# EAGLE design SpiderBackV1 (EAGLE 8.3.1)
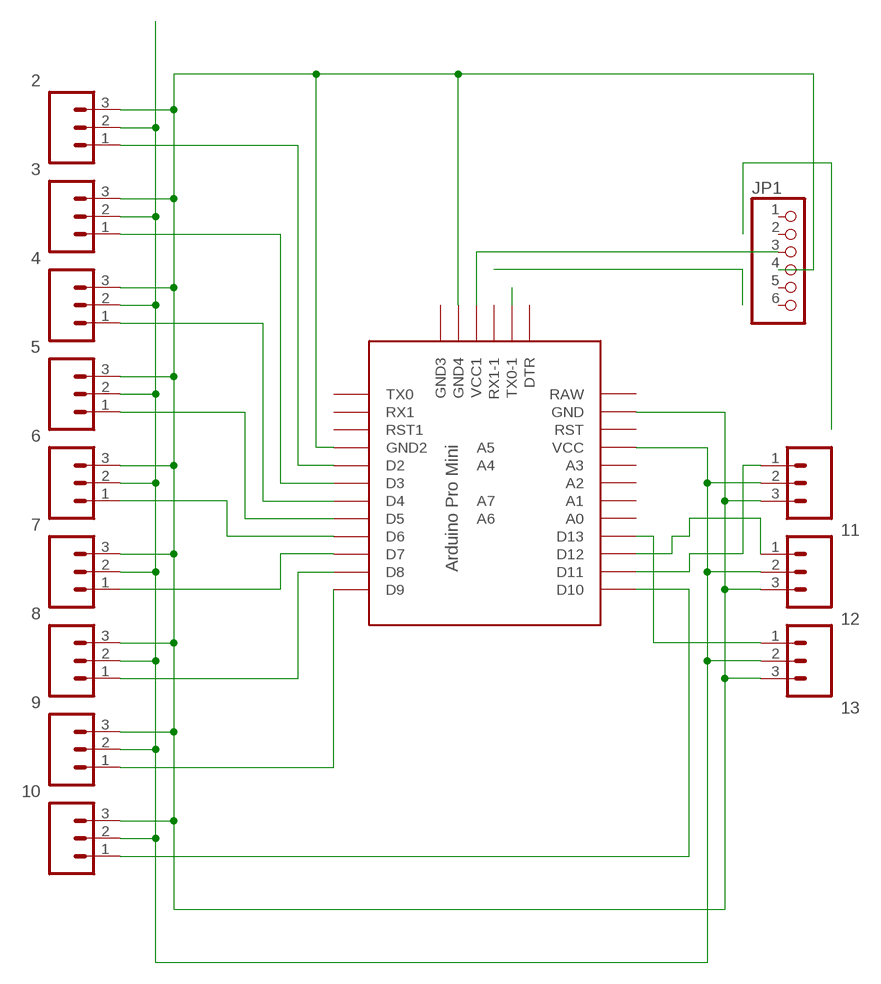
[diagram p0: schematic, sheet 1]

## Parts
2  M03PTH  [1X03]
3  M03PTH  [1X03]
4  M03PTH  [1X03]
5  M03PTH  [1X03]
6  M03PTH  [1X03]
7  M03PTH  [1X03]
8  M03PTH  [1X03]
9  M03PTH  [1X03]
10  M03PTH  [1X03]
11  M03PTH  [1X03]
12  M03PTH  [1X03]
13  M03PTH  [1X03]
JP1  PINHD-1X6CB  [1X06-CLEANBIG]
U$1  PRO-MINI-2  [PRO-MINI-2]

## Nets
N$1: 3.1 U$1.D3
N$2: 2.1 U$1.D2
N$3: 7.1 U$1.D7
N$4: 4.1 U$1.D4
N$5: 5.1 U$1.D5
N$6: 6.1 U$1.D6
N$7: 8.1 U$1.D8
N$8: 9.1 U$1.D9
N$10: U$1.TX0-1
N$11: 2.3 3.3 4.3 5.3 6.3 7.3 8.3 9.3 10.3 11.3 12.3 13.3 JP1.4 U$1.GND U$1.GND1(GND2) U$1.GND3(GND4)
N$12: JP1.3 U$1.VCC1
N$14: 2.2 3.2 4.2 5.2 6.2 7.2 8.2 9.2 10.2 11.2 12.2 13.2 U$1.VCC
N$15: 10.1 U$1.D10
N$16: 11.1 U$1.D11
N$17: 12.1 U$1.D12
N$18: 13.1 U$1.D13
Unconnected: JP1.1 JP1.2 JP1.5 JP1.6 U$1.A0 U$1.A1 U$1.A2 U$1.A3 U$1.A4 U$1.A5 U$1.A6 U$1.A7 U$1.DTR U$1.GND2(GND3) U$1.RAW U$1.RST U$1.RST1 U$1.RX1 U$1.RX1-1 U$1.TX0

## Library data of the parts
2-13 = regis_spider_lib:M03: Header 3 Standard 3-pin 0.1" header. Use with straight break away headers (SKU : PRT-00116), right angle break away headers (PRT-00553), swiss pins (PRT-00743), machine pins (PRT-00117), and female headers (PRT-00115). Molex polarized connector foot print use with SKU : PRT-08232 with associated crimp pins and housings.
JP1 = adafruit:PINHD-1X6: PIN HEADER
U$1 = Arduino-clone:PRO-MINI-2: Arduino Pro Mini Layout 2 Sparkfun.com

## Board
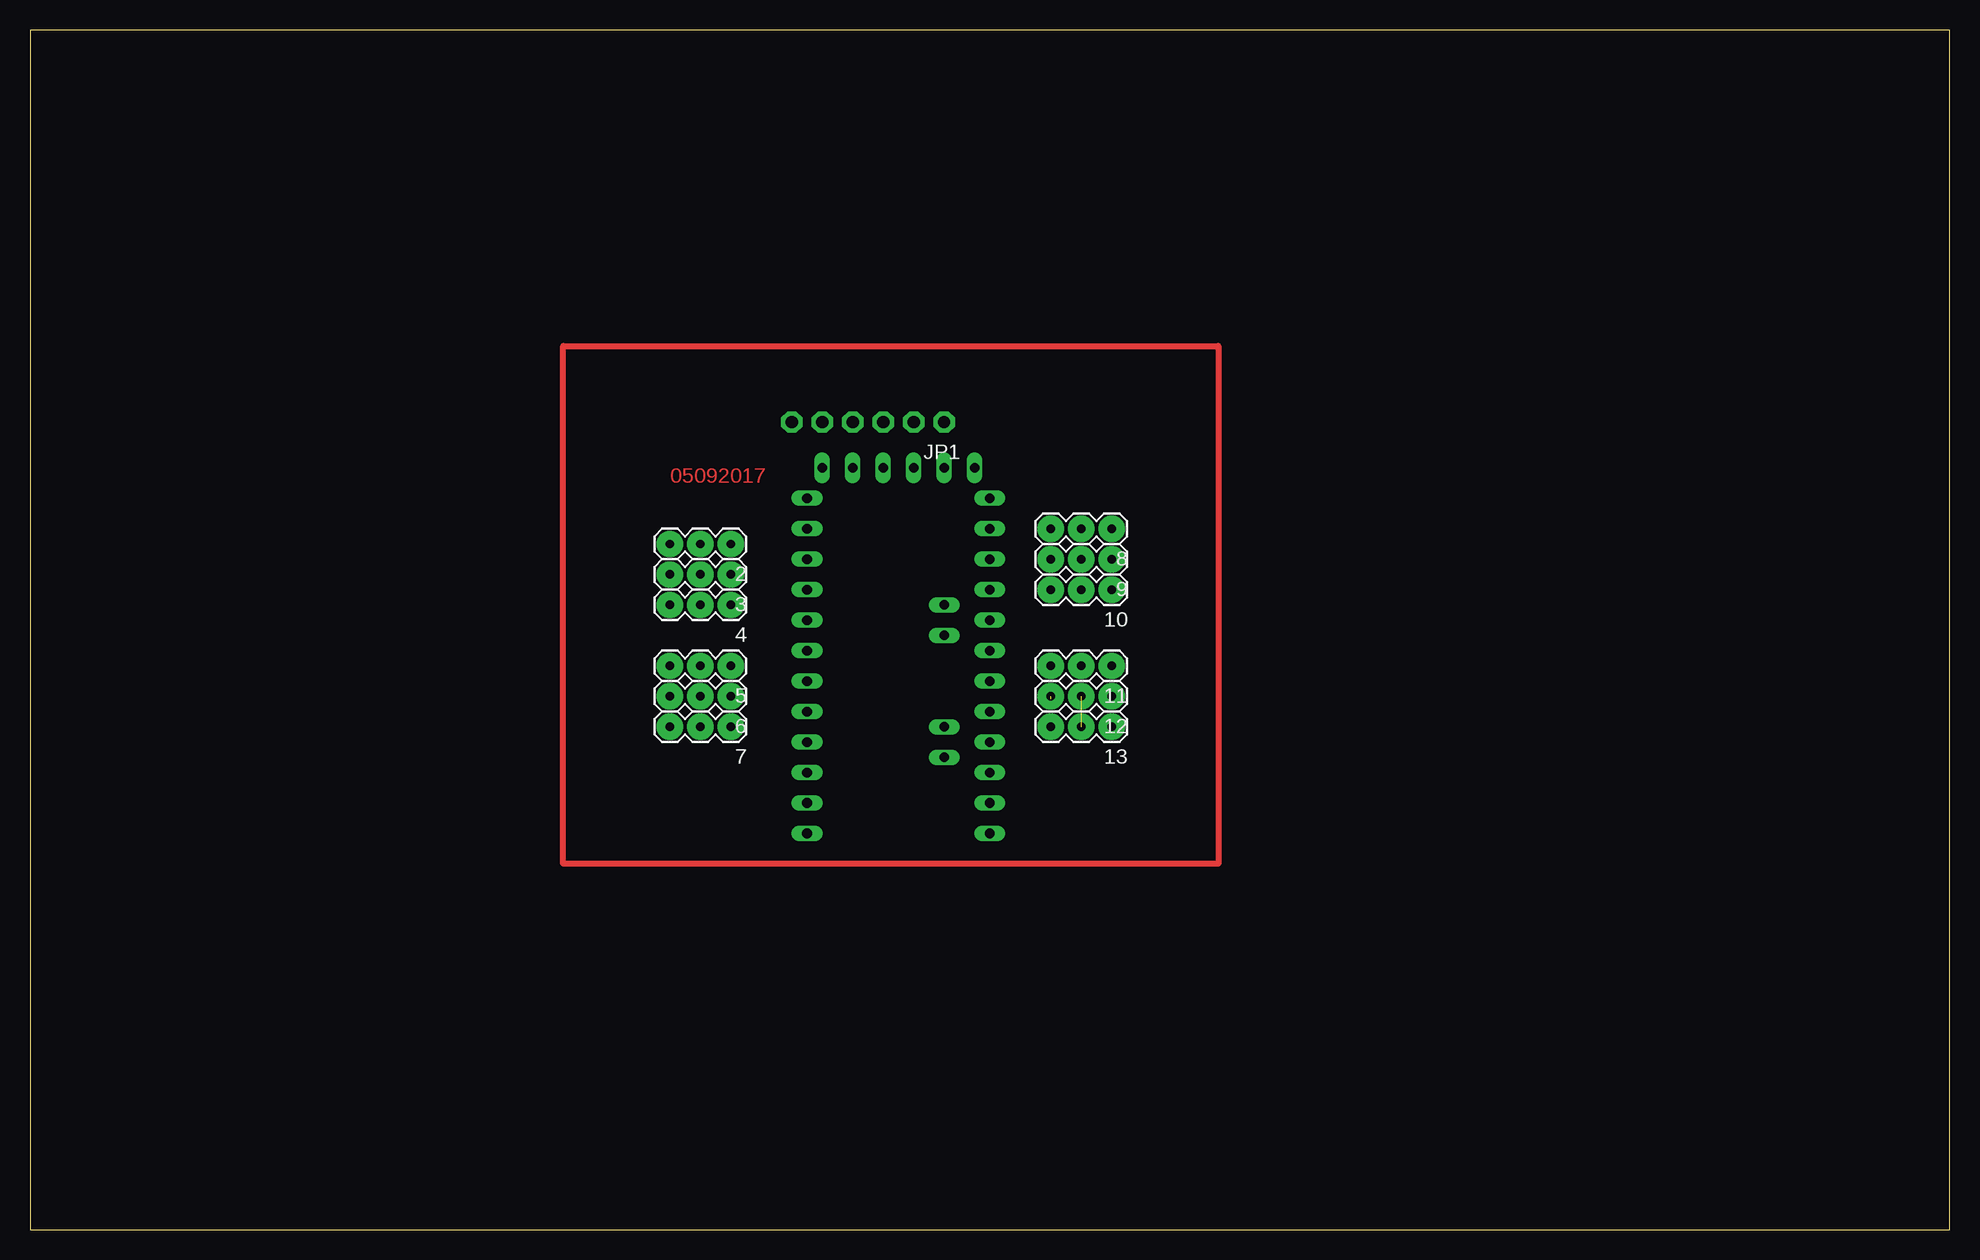
[diagram p1: board, top side]
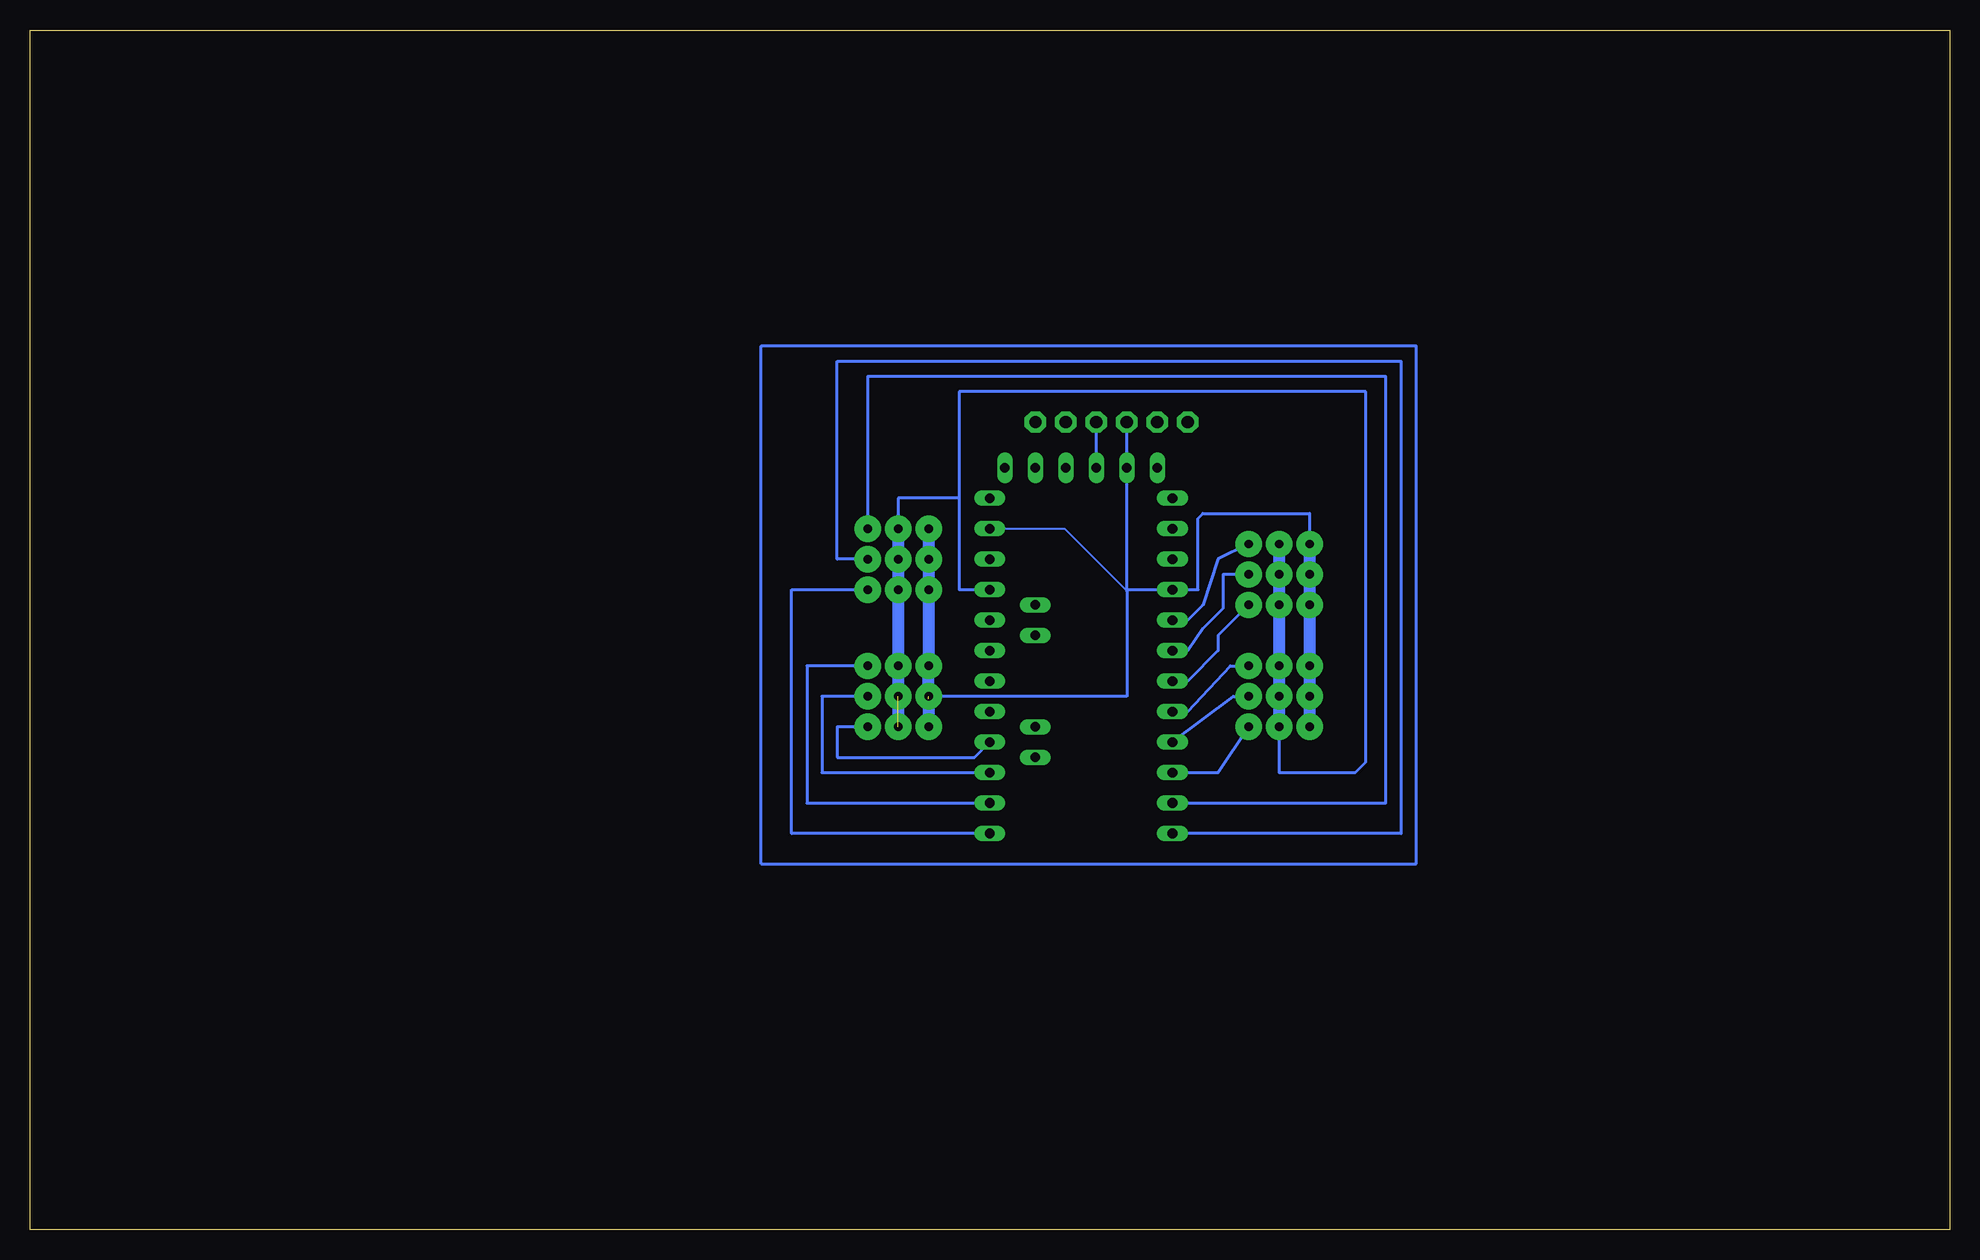
[diagram p2: board, bottom side, seen from below]

Size 160 x 100 mm. Coordinates in mm from the lower left corner, seen from the top.
Outline: 0,0 160,0 160,100 0,100 0,0
Copper layers (1*16): Top 0.035mm / dielectric 1.5mm / Bottom 0.035mm
Design rules "default": minimum track width 6mil, minimum drill 0.35mm, track to track 6mil, track to pad 6mil, pad to pad 6mil, via to via 6mil, smd to smd 6mil, copper to edge 40mil, drill to drill 6mil, minimum pad ring 10mil, minimum via ring 8mil, stop-mask expansion 4mil, vias tented up to drill 0mil, thermal gap 10mil

### Footprints (pad centres in the part's own frame; a part is rotated, then mirrored left to right if it is on the bottom)
1X03 = drill 0.7 pad 2.184: 1 0,0; 2 2.54,0; 3 5.08,0
1X06-CLEANBIG = drill 1.016 pad 1.778 octagon: 1 -6.35,0; 2 -3.81,0; 3 -1.27,0; 4 1.27,0; 5 3.81,0; 6 6.35,0
PRO-MINI-2 = drill 0.8 long: A0 6.35,2.54; A1 6.35,0; A2 6.35,-2.54; A3 6.35,-5.08; A4 2.54,1.27; A5 2.54,3.81; A6 2.54,-8.89; A7 2.54,-6.35; D2 -8.89,2.54; D3 -8.89,0; D4 -8.89,-2.54; D5 -8.89,-5.08; D6 -8.89,-7.62; D7 -8.89,-10.16; D8 -8.89,-12.7; D9 -8.89,-15.24; D10 6.35,-15.24; D11 6.35,-12.7; D12 6.35,-10.16; D13 6.35,-7.62; DTR 5.08,15.24; GND 6.35,10.16; GND1 -8.89,5.08; GND2 -7.62,15.24; GND3 -5.08,15.24; RAW 6.35,12.7; RST 6.35,7.62; RST1 -8.89,7.62; RX1 -8.89,10.16; RX1-1 0,15.24; TX0 -8.89,12.7; TX0-1 2.54,15.24; VCC 6.35,5.08; VCC1 -2.54,15.24

### Placement (x,y rotation side)
2  58.42,57.15 180 top
3  58.42,54.61 180 top
4  58.42,52.07 180 top
5  58.42,46.99 180 top
6  58.42,44.45 180 top
7  58.42,41.91 180 top
8  90.17,58.42 180 top
9  90.17,55.88 180 top
10  90.17,53.34 180 top
11  90.17,46.99 180 top
12  90.17,44.45 180 top
13  90.17,41.91 180 top
JP1  69.85,67.31 180 top
U$1  73.66,48.26 0 top

### Tracks (layer width: path | path; a pad name or v marks a point on that pad's centre or on a via)
N$1
  Bottom 0.254: U$1.D3 63.5,48.26 62.23,50.1 60.55,51.77 60.55,54.61 3.1
N$2
  Bottom 0.254: 2.1 60.96,55.88 62.23,52.07 63.5,50.8 U$1.D2
N$3
  Bottom 0.254: U$1.D7 60.96,38.1 7.1
N$4
  Bottom 0.254: 4.1 60.96,49.53 60.96,48.26 63.5,45.72 U$1.D4
N$5
  Bottom 0.254: 5.1 59.94,46.99 63.5,43.18 U$1.D5
N$6
  Bottom 0.254: U$1.D6 59.69,44.45 6.1
N$7
  Bottom 0.254: U$1.D8 46.99,35.56 46.99,71.12 90.17,71.12 8.1
N$8
  Bottom 0.254: 9.1 92.71,55.88 92.71,72.39 45.72,72.39 45.72,33.02 U$1.D9
N$9
  Bottom 0.254: 99.06,30.48 44.45,30.48 44.45,73.66 99.06,73.66 99.06,30.48
N$11  (1 unrouted)
  Bottom 0.152: U$1.GND 73.78,58.42 68.58,53.22
  Bottom 0.254: 68.58,53.34 U$1.GND3 JP1.4 | 68.58,53.34 U$1.GND1 62.64,53.34 62.64,59.28 62.23,59.69 53.34,59.69 2.3 | 68.58,53.34 68.58,53.22 68.58,44.45 84.89,44.45 85.09,44.25
  Bottom 1.016: 2.3 3.3 4.3 5.3 6.3 7.3 | 8.3 9.3 10.3 11.3 85.09,44.25 13.3
N$12
  Bottom 0.254: U$1.VCC1 JP1.3
N$13
  Top 0.508: 44.45,30.48 44.45,73.66 99.06,73.66 99.06,30.48 44.45,30.48
N$14  (1 unrouted)
  Bottom 0.254: U$1.VCC 82.55,53.34 82.55,60.96 | 82.55,60.96 87.63,60.96 8.2 | 7.2 55.88,38.1 49.53,38.1 48.67,38.96 48.67,69.85 82.55,69.85 82.55,60.96
  Bottom 1.016: 8.2 9.2 10.2 11.2 13.2 | 2.2 3.2 4.2 5.2 6.2 7.2
N$15
  Bottom 0.254: 10.1 96.52,53.34 96.52,33.02 U$1.D10
N$16
  Bottom 0.254: 11.1 95.25,46.99 95.25,35.56 U$1.D11
N$17
  Bottom 0.254: 12.1 93.98,44.45 93.98,38.1 U$1.D12
N$18
  Bottom 0.254: 13.1 92.71,41.91 92.71,39.37 81.28,39.37 U$1.D13

### Text on the board
Top: 05092017
Pads: Spider V1_DuPham